# EAGLE schematic dartBoardATMEGAV1 (EAGLE 9.5.0)
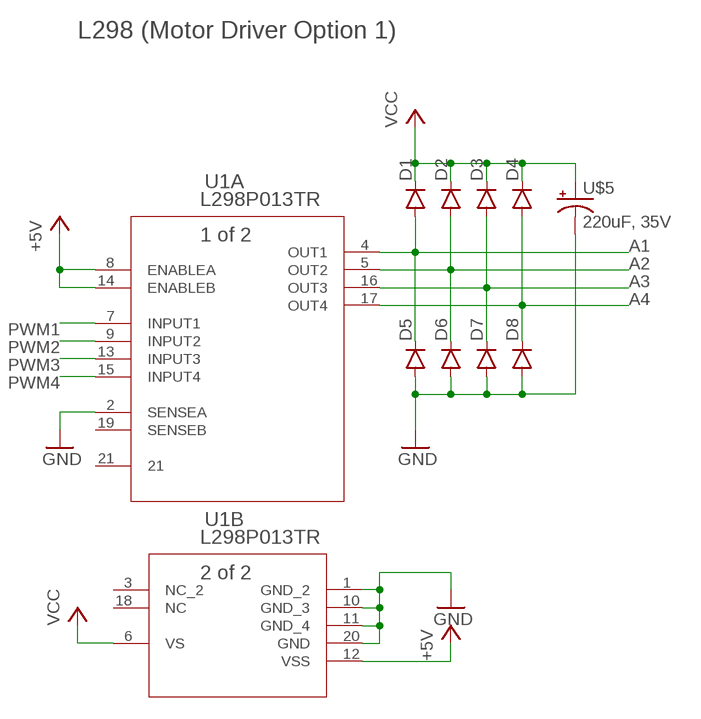
[diagram p0: schematic, sheet 1, part 1 of 2]
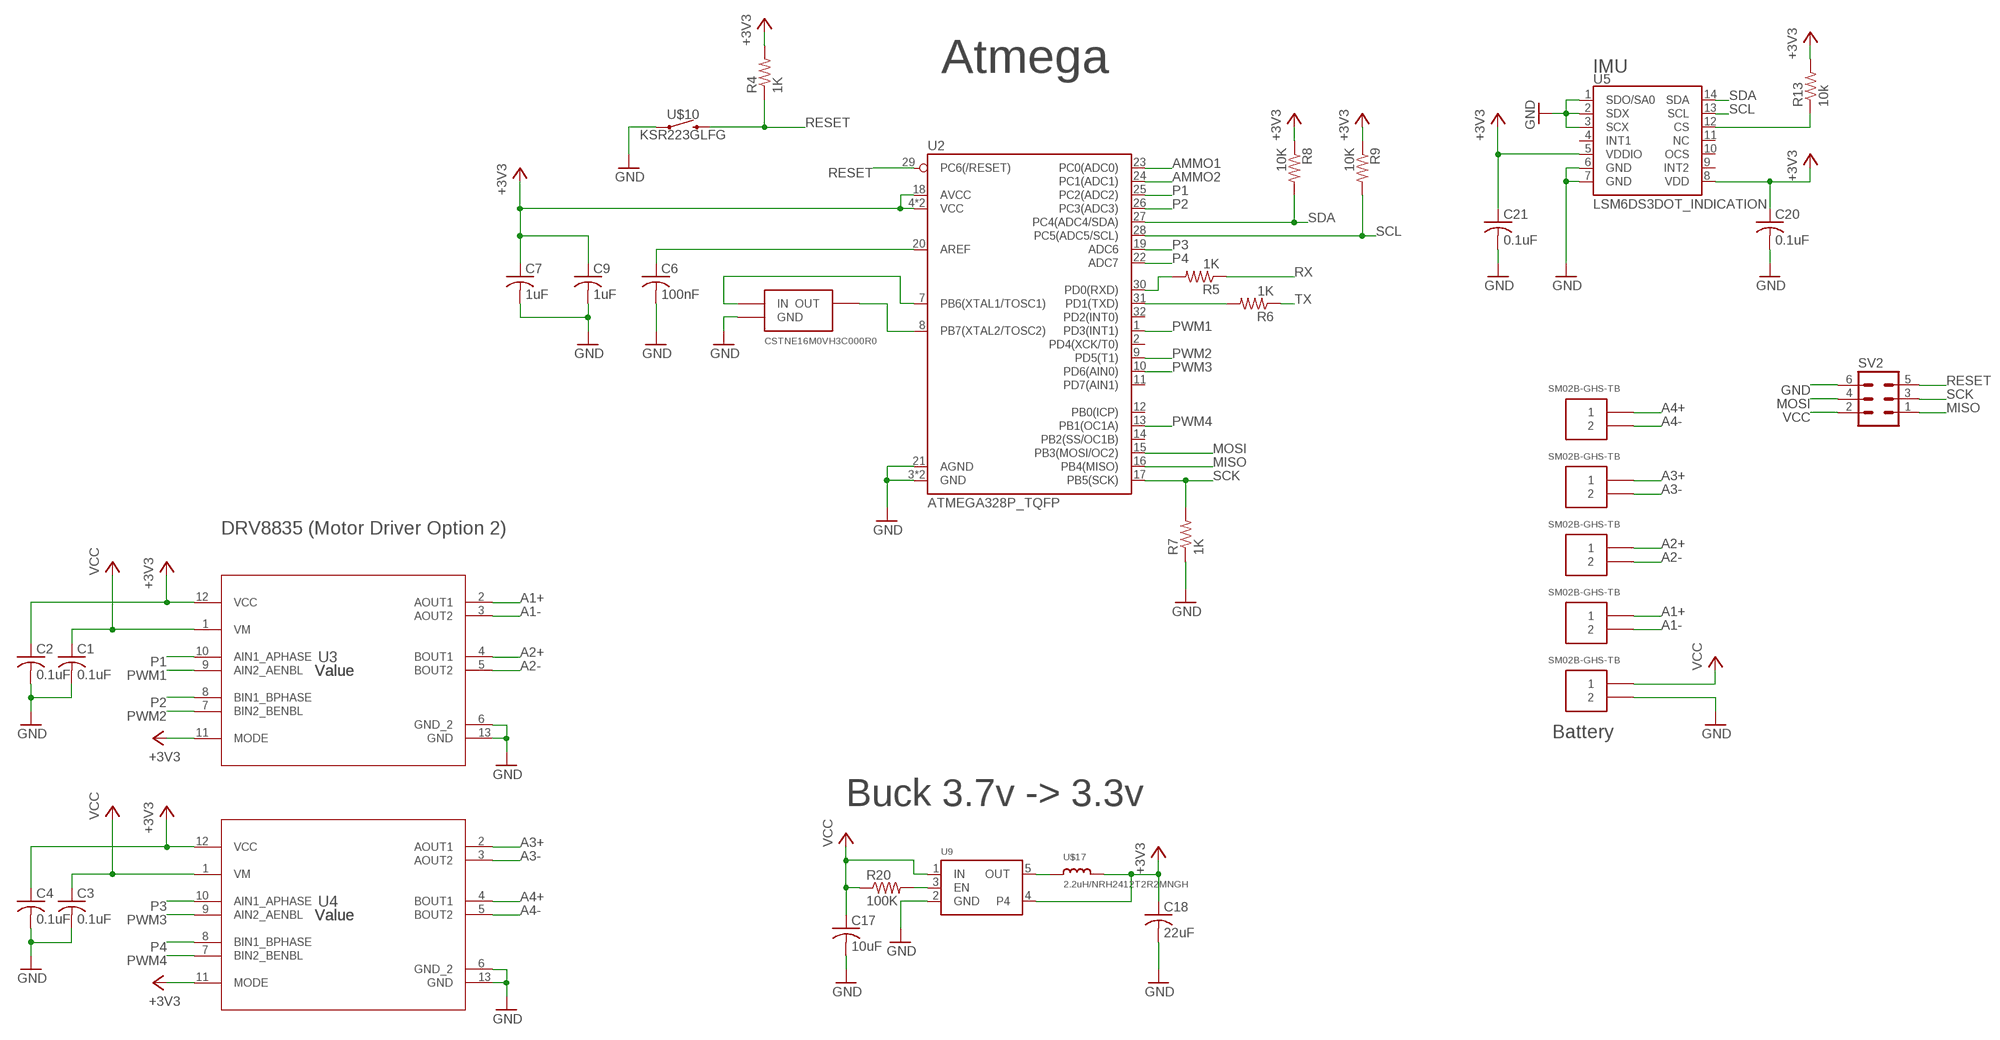
[diagram p1: schematic, sheet 1, part 2 of 2]

## Parts
C1  0.1uF  C-USC0603  [C0603]
C2  0.1uF  C-USC0603  [C0603]
C3  0.1uF  C-USC0603  [C0603]
C4  0.1uF  C-USC0603  [C0603]
C6  100nF  C-USC0603  [C0603]
C7  1uF  C-USC0603  [C0603]
C9  1uF  C-USC0603  [C0603]
C17  10uF  C-USC0603  [C0603]
C18  22uF  C-USC0603  [C0603]
C20  0.1uF  C-USC0603  [C0603]
C21  0.1uF  C-USC0603  [C0603]
D1  DIODEDIODE-123FL  [DIODE_SOD-123FL]
D2  DIODEDIODE-123FL  [DIODE_SOD-123FL]
D3  DIODEDIODE-123FL  [DIODE_SOD-123FL]
D4  DIODEDIODE-123FL  [DIODE_SOD-123FL]
D5  DIODEDIODE-123FL  [DIODE_SOD-123FL]
D6  DIODEDIODE-123FL  [DIODE_SOD-123FL]
D7  DIODEDIODE-123FL  [DIODE_SOD-123FL]
D8  DIODEDIODE-123FL  [DIODE_SOD-123FL]
R4  1K  R-US_R0603  [R0603]
R5  1K  R-US_R0603  [R0603]
R6  1K  R-US_R0603  [R0603]
R7  1K  R-US_R0603  [R0603]
R8  10K  R-US_R0603  [R0603]
R9  10K  R-US_R0603  [R0603]
R13  10k  R-US_R0603  [R0603]
R20  100K  R-US_R0603  [R0603]
SV2  MA03-2  [MA03-2]
U1  L298P013TR  [POWERSO-20]
U2  ATMEGA328P_TQFP  [TQFP32-08]
U3  Value  DRV8835DSSR  [DSS0012A]
U4  Value  DRV8835DSSR  [DSS0012A]
U5  LSM6DS3DOT_INDICATION  [LGA14L_DOT_INDICATOR]
U9  VREG_SOT23-5  [SOT23-5]
U$1  SM02B-GHS-TB  [SM02B-GHS-TB]
U$2  SM02B-GHS-TB  [SM02B-GHS-TB]
U$3  SM02B-GHS-TB  [SM02B-GHS-TB]
U$4  SM02B-GHS-TB  [SM02B-GHS-TB]
U$5  220uF, 35V  CANCAP  [CANCAP]
U$7  CSTNE16M0VH3C000R0  [CSTNE16M0VH3C000R0]
U$10  KSR223GLFG  [KSR223GLFG]
U$15  SM02B-GHS-TB  [SM02B-GHS-TB]
U$17  2.2uH/NRH2412T2R2MNGH  MDKK1616T2R2MM  [MDKK1616T2R2MM]

## Nets
+3V3: C2.1 C4.1 C7.1 C9.1 C18.1 C20.1 C21.1 R4.2 R8.1 R9.1 R13.2 U2.4(VCC) U2.6(VCC) U2.18(AVCC) U3.11(MODE) U3.12(VCC) U4.11(MODE) U4.12(VCC) U5.5(VDDIO) U5.8(VDD) U9.4 U$17.P$2
+5V: U1.8(A:ENABLEA) U1.12(B:VSS) U1.14(A:ENABLEB)
A1: D1.A D5.C U1.4(A:OUT1)
A1+: U3.2(AOUT1) U$1.P$3
A1-: U3.3(AOUT2) U$1.P$4
A2: D2.A D6.C U1.5(A:OUT2)
A2+: U3.4(BOUT1) U$2.P$3
A2-: U3.5(BOUT2) U$2.P$4
A3: D3.A D7.C U1.16(A:OUT3)
A3+: U4.2(AOUT1) U$3.P$3
A3-: U4.3(AOUT2) U$3.P$4
A4: D4.A D8.C U1.17(A:OUT4)
A4+: U4.4(BOUT1) U$4.P$3
A4-: U4.5(BOUT2) U$4.P$4
AMMO1: U2.23(PC0(ADC0))
AMMO2: U2.24(PC1(ADC1))
GND: C1.2 C2.2 C3.2 C4.2 C6.2 C7.2 C9.2 C17.2 C18.2 C20.2 C21.2 D5.A D6.A D7.A D8.A R7.1 SV2.6 U1.1(B:GND_2) U1.2(A:SENSEA) U1.10(B:GND_3) U1.11(B:GND_4) U1.20(B:GND) U2.3(GND) U2.5(GND) U2.21(AGND) U3.6(GND_2) U3.13(GND) U4.6(GND_2) U4.13(GND) U5.1(SDO/SA0) U5.2(SDX) U5.3(SCX) U5.6(GND) U5.7(GND) U9.2(GND) U$5.P$1(-) U$7.2(GND) U$10.P$1 U$15.P$4
MISO: SV2.1 U2.16(PB4(MISO))
MOSI: SV2.4 U2.15(PB3(MOSI/OC2))
N$3: U2.7(PB6(XTAL1/TOSC1)) U$7.1(IN)
N$5: U2.8(PB7(XTAL2/TOSC2)) U$7.3(OUT)
N$6: C6.1 U2.20(AREF)
N$7: R6.2 U2.31(PD1(TXD))
N$8: R5.2 U2.30(PD0(RXD))
N$21: R20.2 U9.3(EN)
N$22: U9.5(OUT) U$17.P$1
N$29: R13.1 U5.12(CS)
P1: U2.25(PC2(ADC2)) U3.10(AIN1_APHASE)
P2: U2.26(PC3(ADC3)) U3.8(BIN1_BPHASE)
P3: U2.19(ADC6) U4.10(AIN1_APHASE)
P4: U2.22(ADC7) U4.8(BIN1_BPHASE)
PWM1: U1.7(A:INPUT1) U2.1(PD3(INT1)) U3.9(AIN2_AENBL)
PWM2: U1.9(A:INPUT2) U2.9(PD5(T1)) U3.7(BIN2_BENBL)
PWM3: U1.13(A:INPUT3) U2.10(PD6(AIN0)) U4.9(AIN2_AENBL)
PWM4: U1.15(A:INPUT4) U2.13(PB1(OC1A)) U4.7(BIN2_BENBL)
RESET: R4.1 SV2.5 U2.29(PC6(/RESET)) U$10.P$2
RX: R5.1
SCK: R7.2 SV2.3 U2.17(PB5(SCK))
SCL: R9.2 U2.28(PC5(ADC5/SCL)) U5.13(SCL)
SDA: R8.2 U2.27(PC4(ADC4/SDA)) U5.14(SDA)
TX: R6.1
VCC: C1.1 C3.1 C17.1 D1.C D2.C D3.C D4.C R20.1 SV2.2 U1.6(B:VS) U3.1(VM) U4.1(VM) U9.1(IN) U$5.P$2(+) U$15.P$3
Unconnected: U1.3(B:NC_2) U1.18(B:NC) U1.19(A:SENSEB) U1.21 U2.2(PD4(XCK/T0)) U2.11(PD7(AIN1)) U2.12(PB0(ICP)) U2.14(PB2(SS/OC1B)) U2.32(PD2(INT0)) U5.4(INT1) U5.9(INT2) U5.10(OCS) U5.11(NC)

## Notes on the sheet
- Atmega | IMU
- L298 (Motor Driver Option 1) | DRV8835 (Motor Driver Option 2)
- Battery
- Buck 3.7v -> 3.3v

## Library data of the parts
C1-C4 C6 C7 C9 C17 C18 C20 C21 = rcl:C-US: CAPACITOR, American symbol; SPICEPREFIX: C
D1-D8 = BeagleBone_Blue_R3:DIODE: Diode These are standard reverse protection diodes and small signal diodes. SMA package can handle up to about 1A. SOD-323 can handle about 200mA. What the SOD-323 package when ordering, there are some mfgs out there that are 5-pin packages.
R4-R9 R13 R20 = rcl:R-US_: RESISTOR, American symbol; SPICEPREFIX: R
SV2 = con-lstb:MA03-2: PIN HEADER; OC_FARNELL: unknown; OC_NEWARK: unknown
U1 = _HenrySilva:L298P013TR; BUILT_BY: EMA_UL_Team; MANUFACTURER_PART_NUMBER: L298P013TR; VENDOR: STMicroelectronics
U2 = SparkFun-IC-Microcontroller:ATMEGA328P_TQFP: Popular 328P in QFP Storefront component: ATmega328 - TQFP <https://www.sparkfun.com/products/13448> (COM-13448) Datasheet <http://www.sparkfun.com/datasheets/Components/SMD/ATMega328.pdf> SparkFun Products SparkFun RedBoard - Programmed with Arduino <https://www.sparkfun.com/products/12757> (DEV-12757) Arduino Pro Mini 328 - 5V/16MHz <https://www.sparkfun.com/products/11113> (DEV-11113) Arduino Pro Mini 328 - 3.3V/8MHz <https://www.sparkfun.com/products/11114> (DEV-11114) SparkFun OpenLog <https://www.sparkfun.com/products/13712> (DEV-13712) SparkFun MicroView - OLED Arduino Module <https://www.sparkfun.com/products/12923> (DEV-12923) SparkFun Digital Sandbox <https://www.sparkfun.com/products/12651> (DEV-12651) SparkFun PicoBoard <https://www.sparkfun.com/products/11888> (WIG-11888) Arduino Fio <https://www.sparkfun.com/products/10116> (DEV-10116) LilyPad Arduino 328 Main Board <https://www.sparkfun.com/products/13342> (DEV-13342) SparkFun RedStick <https://www.sparkfun.com/products/13741> (DEV-13741) LilyPad MP3 <https://www.sparkfun.com/products/11013> (DEV-11013) LilyPad Arduino SimpleSnap <https://www.sparkfun.com/products/10941> (DEV-10941) SparkFun Stepoko <https://www.sparkfun.com/products/13899> (ROB-13899) SparkFun Geiger Counter <https://www.sparkfun.com/products/11345> (SEN-11345) SparkFun EL Sequencer <https://www.sparkfun.com/products/12781> (COM-12781) Arduino Pro 328 - 5V/16MHz <https://www.sparkfun.com/products/10915> (DEV-10915) CryptoCape <https://www.sparkfun.com/products/12773> (DEV-12773) SparkFun IR Thermometer Evaluation Board - MLX90614 <https://www.sparkfun.com/products/10740> (SEN-10740) SparkFun RedBot Mainboard <https://www.sparkfun.com/products/12097> (ROB-12097) Arduino Pro 328 - 3.3V/8MHz <https://www.sparkfun.com/products/10914> (DEV-10914) SparkFun Block for Intel® Edison - Arduino <https://www.sparkfun.com/products/13036> (DEV-13036) SparkFun Simon Says - Surface Mount Soldering Kit <https://www.sparkfun.com/products/10935> (KIT-10935) SparkFun 7-Segment Serial Display - Red <https://www.sparkfun.com/products/11441> (COM-11441) SparkFun 7-Segment Serial Display - White <https://www.sparkfun.com/products/11629> (COM-11629) SparkFun 7-Segment Serial Display - Yellow <https://www.sparkfun.com/products/11443> (COM-11443) SparkFun 7-Segment Serial Display - Kelly Green <https://www.sparkfun.com/products/11440> (COM-11440) SparkFun 7-Segment Serial Display - Blue <https://www.sparkfun.com/products/11442> (COM-11442) SparkFun OpenSegment Serial Display - 20mm (Blue) <https://www.sparkfun.com/products/11647> (COM-11647) SparkFun OpenSegment Serial Display - 20mm (Green) <https://www.sparkfun.com/products/11646> (COM-11646) SparkFun OpenSegment Serial Display - 20mm (White) <https://www.sparkfun.com/products/11648> (COM-11648) SparkFun OpenSegment Serial Display - 20mm (Red) <https://www.sparkfun.com/products/11644> (COM-11644) SparkFun OpenSegment Serial Display - 20mm (Yellow) <https://www.sparkfun.com/products/11645> (COM-11645) SparkFun OpenSegment Shield <https://www.sparkfun.com/products/13190> (DEV-13190); PROD_ID: IC-09069
U3 U4 = _HenrySilva:DRV8835DSSR; MANUFACTURER: Texas Instruments; PARTNUMBER: DRV8835DSSR; REFDES: RefDes; TYPE: TYPE
U5 = _HenrySilva:LSM6DS3; PROD_ID: IC-12969
U9 = microbuilder:VREG_SOT23-5: SOT23-5 Fixed Voltage Regulators To better organise some of the SOT23-5 fixed voltage regulators in this library, this new part was created. Part Current Out V Out V In V Dropout Digikey Part No. ADP121 150mA 3.3V 3.4-5.5V 0.09V @ 150mA ADP121-AUJZ33R7CT-ND ADP121 150mA 3.0V 3.1-5.5V 0.09V @ 150mA ADP121-AUJZ30R7CT-ND ADP122 300mA 3.3V 3.4-5.5V 0.085V @ 300mA ADP122AUJZ-3.3-R7CT-ND ADP1712 300mA 3.3V 3.5-5.5V 0.17V @ 300mA ADP1712AUJZ-3.3-R7TR-ND AP7311 (Low Cost) 150mA 3.3V 3.5-6V 0.15V @ 150mA AP7311-33WG-7DICT-ND LD39015M18R 150mA 1.8V 1.9V-5.5V 0.08V @ 100mA 497-6977-1-ND MCP1824T-3302E/OT 300mA 3.3V 3.5V-6V 0.2V @ 300mA MCP1824T-3302E/OTCT-ND MIC5205-2.5YM5 TR 150mA 2.5V 2.7-16V 0.165V @ 150mA 576-1257-2-ND MIC5205-3.0YM5 TR 150mA 3.0V 3.2V-16V 0.165V @ 150mA 576-1258-2-ND MIC5205-3.3YM5 TR 150mA 3.3V 3.5V-16V 0.165V @ 150mA 576-1259-2-ND TPS780330220 150mA 3.3V+2.2V 3.6-5.5V 250mV Max 296-23332-1-ND TDA3663/N1,135 100mA 3.3V 3.5-45V 0.18V @ 50mA 568-5343-1-ND
U$1-U$4 U$15 = _HenrySilva:SM02B-GHS-TB
U$5 = _HenrySilva:CANCAP
U$7 = HenrySilva:CSTNE16M0VH3C000R0
U$10 = HenrySilva:KSR223GLFG
U$17 = HenrySilva:MDKK1616T2R2MM